# Altium schematic sheet converter.SchDoc
size A4; SheetNumber: 3; SheetTotal: 4
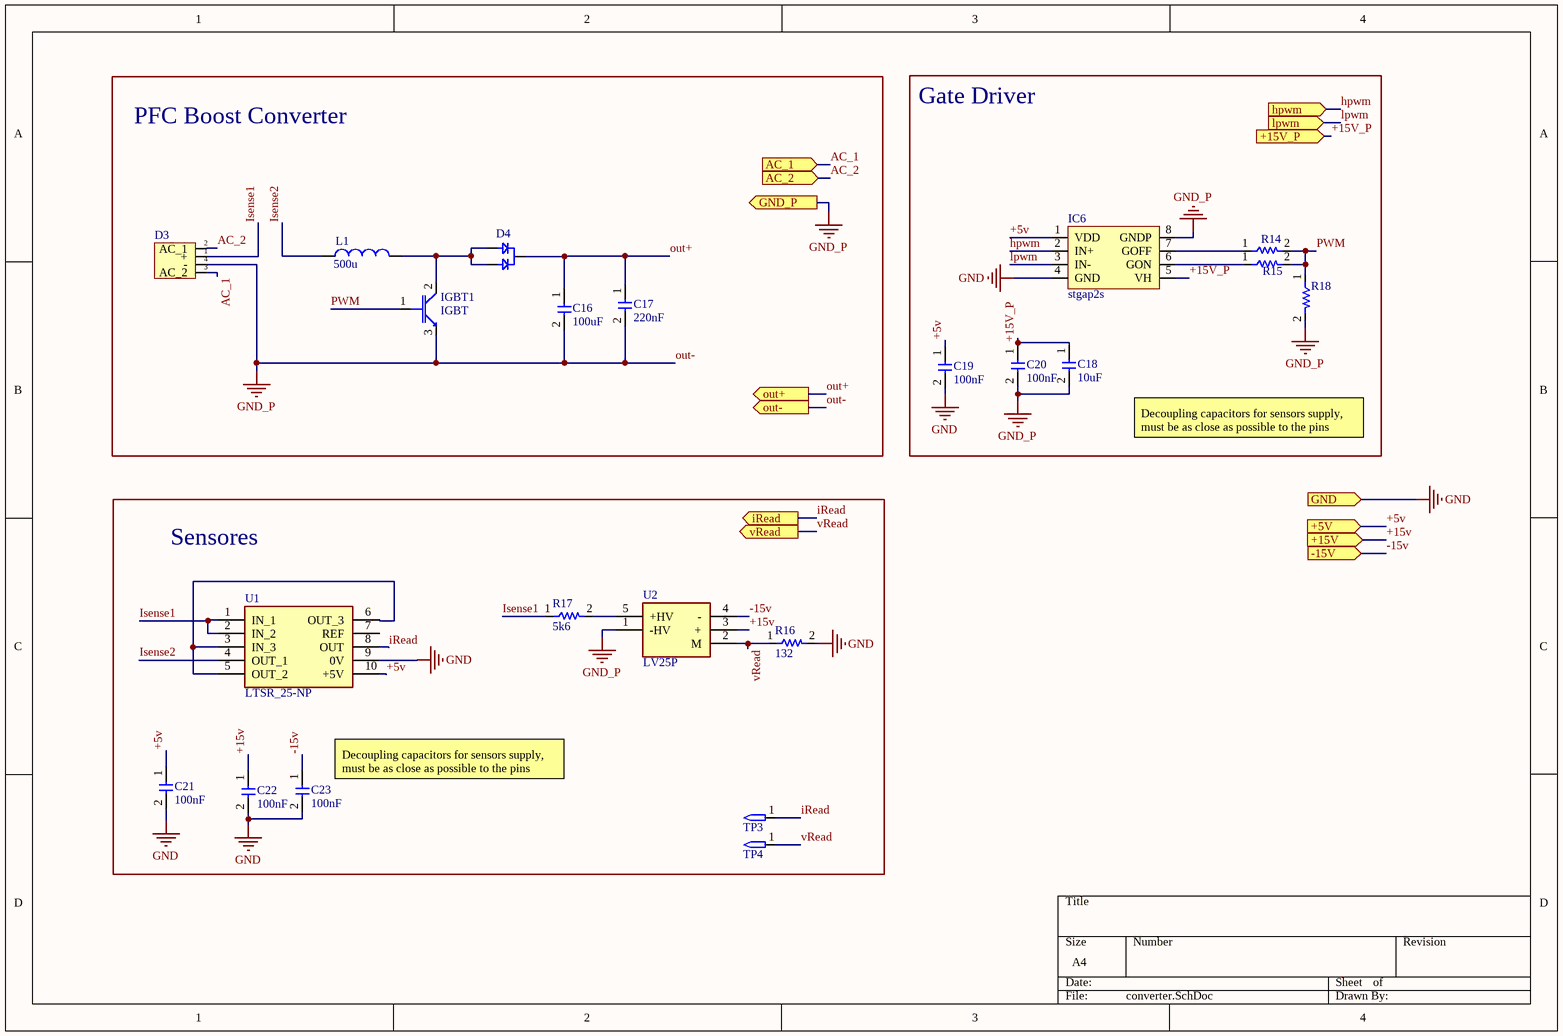
[diagram p0: converter.SchDoc]

## Parts
C16  100uF  [CAP 20x12.5]
C17  220nF  [CAPACITOR 220nF]
C18  10uF  [CAPACITOR_0805]
C19  100nF  [CAPACITOR_0805]
C20  100nF  [CAPACITOR_0805]
C21  100nF  [CAPACITOR_0805]
C22  100nF  [CAPACITOR_0805]
C23  100nF  [CAPACITOR_0805]
D3  rectifierBridge  [GBI10M]  (value not drawn)
D4  Diode dual  [D2PAK]  (value not drawn)
IC6  stgap2s  [SO-8]
IGBT1  IGBT  [D2PAK]
L1  500u  [INDUCTOR 500u]
R14  Resistor  [RESISTOR_0805]  (value not drawn)
R15  Resistor  [RESISTOR_0805]  (value not drawn)
R16  132  [RESISTOR_0805]
R17  5k6  [RESISTOR_0805]
R18  Resistor  [RESISTOR_0805]  (value not drawn)
TP3  TestPoint  [TestPoint]  (value not drawn)
TP4  TestPoint  [TestPoint]  (value not drawn)
U1  LTSR_25-NP  [LTSR25-NP]
U2  LV25P  [LV-25-P/LV-20-P]

## Blocks framed on the sheet
PFC Boost Converter: C16 C17 D3 D4 IGBT1 L1
Gate Driver: C18-C20 IC6 R14 R15 R18
Sensores: C21-C23 R16 R17 TP3 TP4 U1 U2

## Ports
+5V (in, see pfc[3B], powerReg[3C], uController[4A]), +15V (in, see pfc[3B], powerReg[3B], uController[4C]), +15V_P (in, see pfc[3B], powerReg[2A]), -15V (in, see pfc[3B], powerReg[3B]), AC_1 (in, see pfc[3B], powerReg[2A]), AC_2 (in, see pfc[3B], powerReg[2A]), GND (in, see pfc[3B], powerReg[3C], uController[4A]), GND_P (out, see pfc[3B], powerReg[2A]), hpwm (in, see pfc[3A], uController[2A]), iRead (out, see pfc[3A], uController[4A]), lpwm (in, see pfc[3B], uController[2A]), out+ (out, see pfc[3B], powerReg[2A]), out- (out, see pfc[3B], powerReg[2A]), vRead (out, see pfc[3B], uController[4A])

## Nets
GND: C19.2 C21.2 C22.2 C23.2 IC6.4(GND) R16.2 U1.9(0V) ; port GND
out-: C16.2 C17.2 C18.2 C20.2 D3.4(-) IC6.8(GNDP) IGBT1.3 R18.2 U2.1(-HV) ; port GND_P, port out-  [also labelled GND_P]
+5v: C19.1 C21.1 IC6.1(VDD) U1.10(+5V) ; port +5V
+15v: C22.1 U2.3(+) ; port +15V
+15V_P: C18.1 C20.1 IC6.5(VH) ; port +15V_P
-15v: C23.1 U2.4(-) ; port -15V
AC_1: D3.3(AC_2) ; port AC_1
AC_2: D3.2(AC_1) ; port AC_2
hpwm: IC6.2(IN+) ; port hpwm
iRead: TP3.1 U1.8(OUT) ; port iRead
Isense1: D3.1(+) R17.1 U1.1(IN_1) U1.2(IN_2)
Isense2: L1.1 U1.4(OUT_1)
lpwm: IC6.3(IN-) ; port lpwm
out+: C16.1 C17.1 D4.2 ; port out+
PWM: IGBT1.1 R14.2 R15.2 R18.1
vRead: R16.1 TP4.1 U2.2(M) ; port vRead
NetD4_1: D4.1 D4.3 IGBT1.2 L1.2
NetIC6_6: IC6.6(GON) R15.1
NetIC6_7: IC6.7(GOFF) R14.1
NetR17_2: R17.2 U2.5(+HV)
NetU1_3: U1.3(IN_3) U1.5(OUT_2) U1.6(OUT_3)

Not connected (* = marked no-connect by the designer): U1 7(REF)

## Notes on the sheet
- Decoupling capacitors for sensors supply, must be as close as possible to the pins
- (near C23) Decoupling capacitors for sensors supply, must be as close as possible to the pins

## Library data of the parts
C16-C23 = Capacitor
L1 = Inductor: SimulationGenericComponent: True
R16 = Resistor: 82.5 mW
R17 = Resistor: 140 mW
U1 = LTSR_25-NP: Undefined or Miscellaneous; Manufacturer_Name: LEM; Manufacturer_Part_Number: LTSR 25-NP; Datasheet Link: https://datasheet.datasheetarchive.com/originals/distributors/Datasheets-16/DSA-314824.pdf
U2 = LV25P: Undefined or Miscellaneous; Manufacturer_Name: LEM; Manufacturer_Part_Number: LV25P